# Altium project NES-NROM.PrjPCB
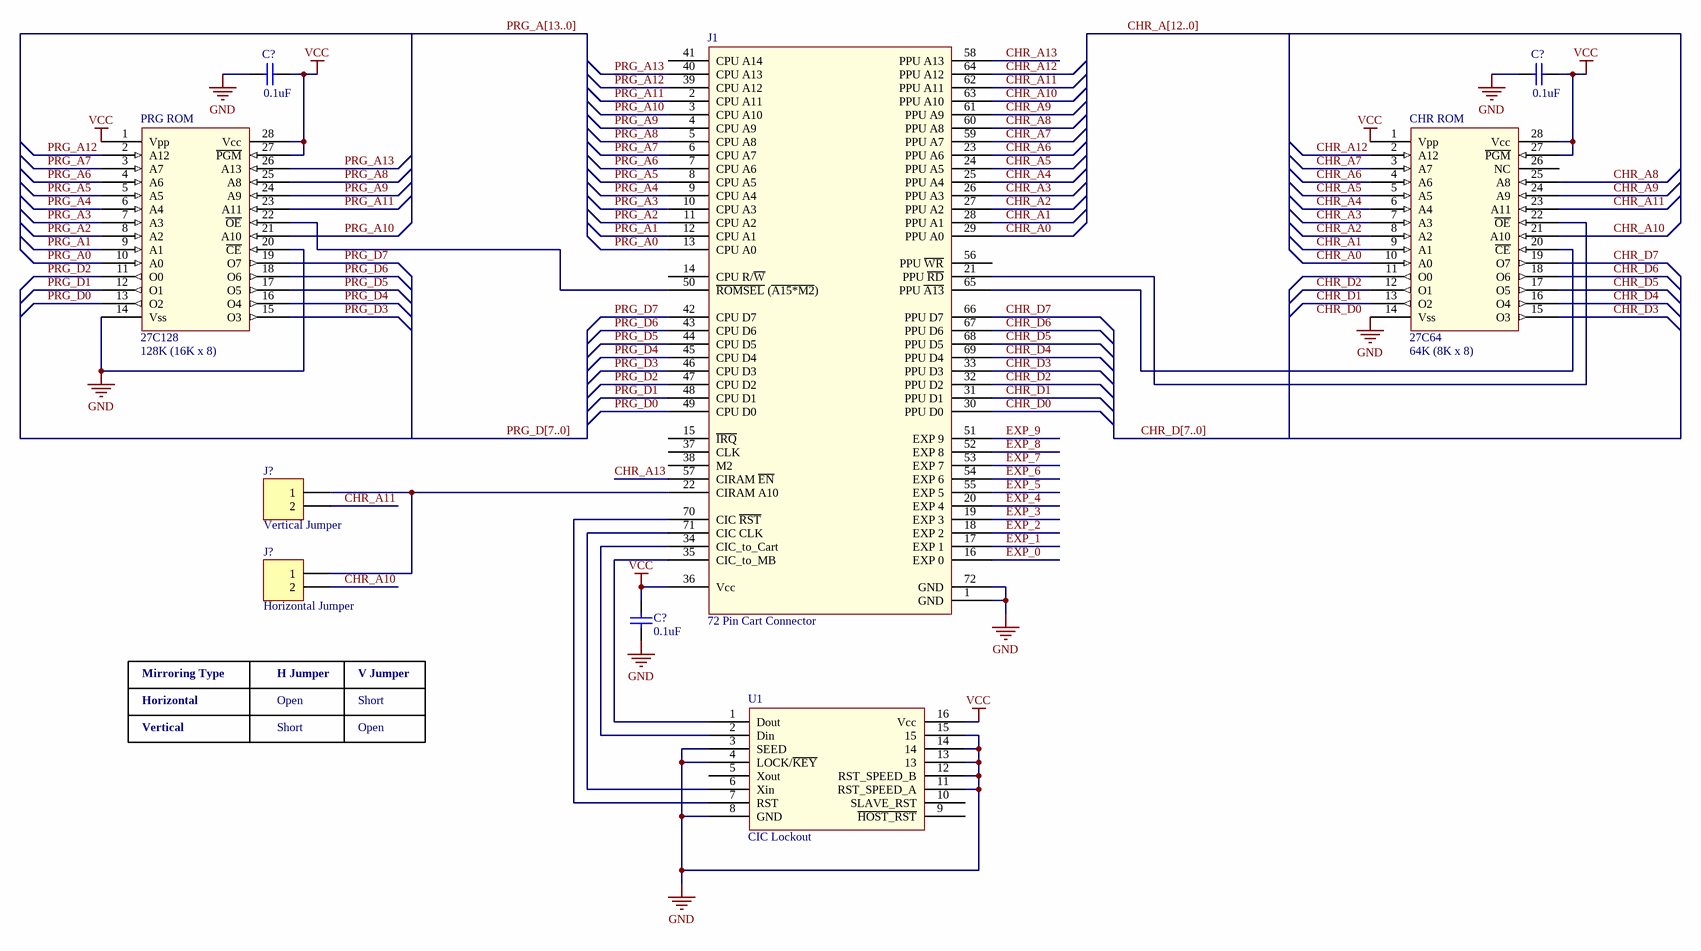
[diagram p0: NES-NROM-128.SchDoc]
ProjectRevision: 1-0-0
2 sheets, 18 parts. Net scope: global (net labels, ports and power ports of the same name join across sheets).
Sheets:
  NES-NROM-128.SchDoc
  NES-NROM-256.SchDoc

## Sheet NES-NROM-128.SchDoc: NES-NROM-128 Cartridge
size Tabloid; DrawnBy: M. Spinks; Revision: 1.0; SheetNumber: 1; SheetTotal: 1; PageSetup: Record=PageOptions|CenterHorizontal=True|CenterVertical=True|PrintScale=0.98|XCorrection=1.00|YCorrection=1.00|PrintKind=1|BorderSize=5000000|LeftOffset=0|BottomOffset=0|Orientation=2|PaperLength=1000|PaperWidth=1000|Scale=100|PaperSource=7|PrintQuality=-4|MediaType=1|DitherType=10|PaperKind=Tabloid|PrintScaleMode=1

### Parts
(Parts that share a designator on the sheet are numbered #1, #2 ... from top to bottom, then left to right.)
C?#1  value 0.1uF  [C1206]  (hidden comment: Cap Semi)
C?#2  value 0.1uF  [C1206]  (hidden comment: Cap Semi)
C?#3  value 0.1uF  [C1206]  (hidden comment: Cap Semi)
CHR_ROM#1  27C64  Memory Size: 64K (8K x 8)  [DIP600-JW28]
J1#1  72 Pin Cart Connector
J?#1  Vertical Jumper  [HDR1X2]
J?#2  Horizontal Jumper  [HDR1X2]
PRG_ROM#1  27C128  Memory Size: 128K (16K x 8)  [DIP600-JW28]
U1#1  CIC Lockout  [DIP16]

### Nets
GND: C?#1.1 C?#2.1 C?#3.1 CHR_ROM#1.14(Vss) J1#1.1(GND) J1#1.72(GND) PRG_ROM#1.14(Vss) PRG_ROM#1.20(~{CE}) U1#1.3(SEED) U1#1.4(LOCK/~{KEY}) U1#1.8(GND) U1#1.11(RST_SPEED_A) U1#1.12(RST_SPEED_B) U1#1.13 U1#1.14 U1#1.15
VCC: C?#1.2 C?#2.2 C?#3.2 CHR_ROM#1.1(Vpp) CHR_ROM#1.27(~{PGM}) CHR_ROM#1.28(Vcc) J1#1.36(Vcc) PRG_ROM#1.1(Vpp) PRG_ROM#1.27(~{PGM}) PRG_ROM#1.28(Vcc) U1#1.16(Vcc)
CHR_A0: CHR_ROM#1.10(A0) J1#1.29(PPU_A0)
CHR_A1: CHR_ROM#1.9(A1) J1#1.28(PPU_A1)
CHR_A2: CHR_ROM#1.8(A2) J1#1.27(PPU_A2)
CHR_A3: CHR_ROM#1.7(A3) J1#1.26(PPU_A3)
CHR_A4: CHR_ROM#1.6(A4) J1#1.25(PPU_A4)
CHR_A5: CHR_ROM#1.5(A5) J1#1.24(PPU_A5)
CHR_A6: CHR_ROM#1.4(A6) J1#1.23(PPU_A6)
CHR_A7: CHR_ROM#1.3(A7) J1#1.59(PPU_A7)
CHR_A8: CHR_ROM#1.25(A8) J1#1.60(PPU_A8)
CHR_A9: CHR_ROM#1.24(A9) J1#1.61(PPU_A9)
CHR_A10: CHR_ROM#1.21(A10) J1#1.63(PPU_A10) J?#2.2
CHR_A11: CHR_ROM#1.23(A11) J1#1.62(PPU_A11) J?#1.2
CHR_A12: CHR_ROM#1.2(A12) J1#1.64(PPU_A12)
CHR_A13: J1#1.57(CIRAM_~{EN}) J1#1.58(PPU_A13)
CHR_D0: J1#1.30(PPU_D0)
CHR_D1: CHR_ROM#1.13(O2) J1#1.31(PPU_D1)
CHR_D2: CHR_ROM#1.12(O1) J1#1.32(PPU_D2)
CHR_D3: CHR_ROM#1.15(O3) J1#1.33(PPU_D3)
CHR_D4: CHR_ROM#1.16(O4) J1#1.69(PPU_D4)
CHR_D5: CHR_ROM#1.17(O5) J1#1.68(PPU_D5)
CHR_D6: CHR_ROM#1.18(O6) J1#1.67(PPU_D6)
CHR_D7: CHR_ROM#1.19(O7) J1#1.66(PPU_D7)
EXP_0: J1#1.16(EXP_0)
EXP_1: J1#1.17(EXP_1)
EXP_2: J1#1.18(EXP_2)
EXP_3: J1#1.19(EXP_3)
EXP_4: J1#1.20(EXP_4)
EXP_5: J1#1.55(EXP_5)
EXP_6: J1#1.54(EXP_6)
EXP_7: J1#1.53(EXP_7)
EXP_8: J1#1.52(EXP_8)
EXP_9: J1#1.51(EXP_9)
PRG_A0: J1#1.13(CPU_A0) PRG_ROM#1.10(A0)
PRG_A1: J1#1.12(CPU_A1) PRG_ROM#1.9(A1)
PRG_A2: J1#1.11(CPU_A2) PRG_ROM#1.8(A2)
PRG_A3: J1#1.10(CPU_A3) PRG_ROM#1.7(A3)
PRG_A4: J1#1.9(CPU_A4) PRG_ROM#1.6(A4)
PRG_A5: J1#1.8(CPU_A5) PRG_ROM#1.5(A5)
PRG_A6: J1#1.7(CPU_A6) PRG_ROM#1.4(A6)
PRG_A7: J1#1.6(CPU_A7) PRG_ROM#1.3(A7)
PRG_A8: J1#1.5(CPU_A8) PRG_ROM#1.25(A8)
PRG_A9: J1#1.4(CPU_A9) PRG_ROM#1.24(A9)
PRG_A10: J1#1.3(CPU_A10) PRG_ROM#1.21(A10)
PRG_A11: J1#1.2(CPU_A11) PRG_ROM#1.23(A11)
PRG_A12: J1#1.39(CPU_A12) PRG_ROM#1.2(A12)
PRG_A13: J1#1.40(CPU_A13) PRG_ROM#1.26(A13)
PRG_D0: J1#1.49(CPU_D0) PRG_ROM#1.13(O2)
PRG_D1: J1#1.48(CPU_D1) PRG_ROM#1.12(O1)
PRG_D2: J1#1.47(CPU_D2) PRG_ROM#1.11(O0)
PRG_D3: J1#1.46(CPU_D3) PRG_ROM#1.15(O3)
PRG_D4: J1#1.45(CPU_D4) PRG_ROM#1.16(O4)
PRG_D5: J1#1.44(CPU_D5) PRG_ROM#1.17(O5)
PRG_D6: J1#1.43(CPU_D6) PRG_ROM#1.18(O6)
PRG_D7: J1#1.42(CPU_D7) PRG_ROM#1.19(O7)
NetCHR_ROM#1_20: CHR_ROM#1.20(~{CE}) J1#1.65(PPU_~{A13})
NetCHR_ROM#1_22: CHR_ROM#1.22(~{OE}) J1#1.21(PPU_~{RD})
NetJ1#1_22: J1#1.22(CIRAM_A10) J?#1.1 J?#2.1
NetJ1#1_34: J1#1.34(CIC_to_Cart) U1#1.2(Din)
NetJ1#1_35: J1#1.35(CIC_to_MB) U1#1.1(Dout)
NetJ1#1_50: J1#1.50(~{ROMSEL}_(~{A15*M2})) PRG_ROM#1.22(~{OE})
NetJ1#1_70: J1#1.70(CIC_~{RST}) U1#1.7(RST)
NetJ1#1_71: J1#1.71(CIC_CLK) U1#1.6(Xin)

Not connected (* = marked no-connect by the designer): CHR_ROM#1 11(O0) 26(NC); J1#1 14(CPU_R/~{W}) 15(~{IRQ}) 37(CLK) 38(M2) 41(CPU_A14) 56(PPU_~{WR}); U1#1 5(Xout) 9(~{HOST_RST}) 10(SLAVE_RST)

### Buses and harness runs
bus CHR_A[12..0]
bus CHR_D[7..0]
bus PRG_A[13..0]
bus PRG_D[7..0]

### Notes on the sheet
- Mirroring Type
- H Jumper
- V Jumper
- Horizontal
- Vertical
- Open
- Short
- Labels drawn without touching a wire or pin: CHR_D0
- Title
- Size:
- Date:
- Ledger
- Drawn By:
- Time:
- Revision:
- Sheet
- of
- File:

### Library data of the parts
C?#1-C?#3 = Cap Semi: Capacitor (Semiconductor SIM Model); Published: 8-Jun-2000; LatestRevisionDate: 29-May-2009; LatestRevisionNote: IPC-7351 Footprint Added.; PackageReference: C1206; Publisher: Altium Limited; PackageDescription: Chip Capacitor
CHR_ROM#1 = 27C64: 64K bit (8K x 8) EPROM - 28 pin
J1#1 = 72 Pin Cart: 72 Pin Cartridge Connector
J?#1 J?#2 = Header 2: Header, 2-Pin; LatestRevisionDate: 17-Jul-2002; LatestRevisionNote: Re-released for DXP Platform.; Publisher: Altium Limited
PRG_ROM#1 = 27C128: 128K bit (16K x 8) EPROM - 28 pin
U1#1 = CIC: 10NES CIC Lockout Chip

## Sheet NES-NROM-256.SchDoc: NES-NROM-256 Cartridge
size Tabloid; DrawnBy: M. Spinks; Revision: 1.0; SheetNumber: 1; SheetTotal: 1; PageSetup: Record=PageOptions|CenterHorizontal=True|CenterVertical=True|PrintScale=0.98|XCorrection=1.00|YCorrection=1.00|PrintKind=1|BorderSize=5000000|LeftOffset=0|BottomOffset=0|Orientation=2|PaperLength=1000|PaperWidth=1000|Scale=100|PaperSource=7|PrintQuality=-4|MediaType=1|DitherType=10|PaperKind=Tabloid|PrintScaleMode=1
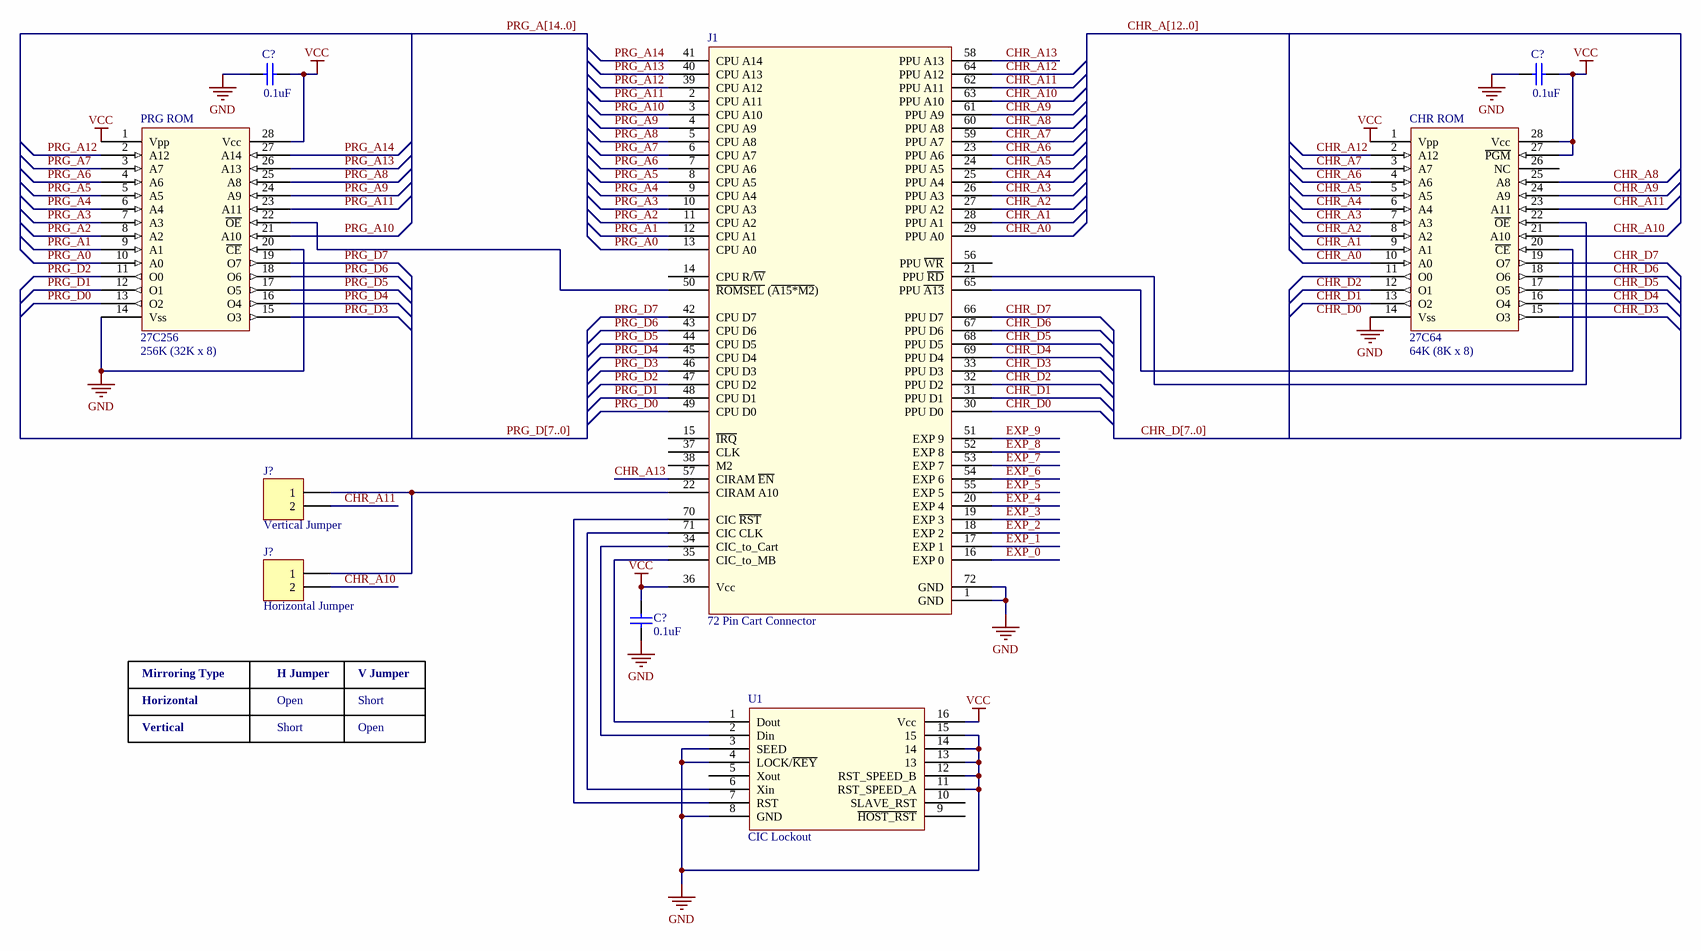
[diagram p1: NES-NROM-256.SchDoc]

### Parts
(Parts that share a designator on the sheet are numbered #1, #2 ... from top to bottom, then left to right.)
C?#4  value 0.1uF  [C1206]  (hidden comment: Cap Semi)
C?#5  value 0.1uF  [C1206]  (hidden comment: Cap Semi)
C?#6  value 0.1uF  [C1206]  (hidden comment: Cap Semi)
CHR_ROM#2  27C64  Memory Size: 64K (8K x 8)  [DIP600-JW28]
J1#2  72 Pin Cart Connector
J?#3  Vertical Jumper  [HDR1X2]
J?#4  Horizontal Jumper  [HDR1X2]
PRG_ROM#2  27C256  Memory Size: 256K (32K x 8)  [DIP600-JW28]
U1#2  CIC Lockout  [DIP16]

### Nets
GND: C?#4.1 C?#5.1 C?#6.1 CHR_ROM#2.14(Vss) J1#2.1(GND) J1#2.72(GND) PRG_ROM#2.14(Vss) PRG_ROM#2.20(~{CE}) U1#2.3(SEED) U1#2.4(LOCK/~{KEY}) U1#2.8(GND) U1#2.11(RST_SPEED_A) U1#2.12(RST_SPEED_B) U1#2.13 U1#2.14 U1#2.15
VCC: C?#4.2 C?#5.2 C?#6.2 CHR_ROM#2.1(Vpp) CHR_ROM#2.27(~{PGM}) CHR_ROM#2.28(Vcc) J1#2.36(Vcc) PRG_ROM#2.1(Vpp) PRG_ROM#2.28(Vcc) U1#2.16(Vcc)
CHR_A0: CHR_ROM#2.10(A0) J1#2.29(PPU_A0)
CHR_A1: CHR_ROM#2.9(A1) J1#2.28(PPU_A1)
CHR_A2: CHR_ROM#2.8(A2) J1#2.27(PPU_A2)
CHR_A3: CHR_ROM#2.7(A3) J1#2.26(PPU_A3)
CHR_A4: CHR_ROM#2.6(A4) J1#2.25(PPU_A4)
CHR_A5: CHR_ROM#2.5(A5) J1#2.24(PPU_A5)
CHR_A6: CHR_ROM#2.4(A6) J1#2.23(PPU_A6)
CHR_A7: CHR_ROM#2.3(A7) J1#2.59(PPU_A7)
CHR_A8: CHR_ROM#2.25(A8) J1#2.60(PPU_A8)
CHR_A9: CHR_ROM#2.24(A9) J1#2.61(PPU_A9)
CHR_A10: CHR_ROM#2.21(A10) J1#2.63(PPU_A10) J?#4.2
CHR_A11: CHR_ROM#2.23(A11) J1#2.62(PPU_A11) J?#3.2
CHR_A12: CHR_ROM#2.2(A12) J1#2.64(PPU_A12)
CHR_A13: J1#2.57(CIRAM_~{EN}) J1#2.58(PPU_A13)
CHR_D0: J1#2.30(PPU_D0)
CHR_D1: CHR_ROM#2.13(O2) J1#2.31(PPU_D1)
CHR_D2: CHR_ROM#2.12(O1) J1#2.32(PPU_D2)
CHR_D3: CHR_ROM#2.15(O3) J1#2.33(PPU_D3)
CHR_D4: CHR_ROM#2.16(O4) J1#2.69(PPU_D4)
CHR_D5: CHR_ROM#2.17(O5) J1#2.68(PPU_D5)
CHR_D6: CHR_ROM#2.18(O6) J1#2.67(PPU_D6)
CHR_D7: CHR_ROM#2.19(O7) J1#2.66(PPU_D7)
EXP_0: J1#2.16(EXP_0)
EXP_1: J1#2.17(EXP_1)
EXP_2: J1#2.18(EXP_2)
EXP_3: J1#2.19(EXP_3)
EXP_4: J1#2.20(EXP_4)
EXP_5: J1#2.55(EXP_5)
EXP_6: J1#2.54(EXP_6)
EXP_7: J1#2.53(EXP_7)
EXP_8: J1#2.52(EXP_8)
EXP_9: J1#2.51(EXP_9)
PRG_A0: J1#2.13(CPU_A0) PRG_ROM#2.10(A0)
PRG_A1: J1#2.12(CPU_A1) PRG_ROM#2.9(A1)
PRG_A2: J1#2.11(CPU_A2) PRG_ROM#2.8(A2)
PRG_A3: J1#2.10(CPU_A3) PRG_ROM#2.7(A3)
PRG_A4: J1#2.9(CPU_A4) PRG_ROM#2.6(A4)
PRG_A5: J1#2.8(CPU_A5) PRG_ROM#2.5(A5)
PRG_A6: J1#2.7(CPU_A6) PRG_ROM#2.4(A6)
PRG_A7: J1#2.6(CPU_A7) PRG_ROM#2.3(A7)
PRG_A8: J1#2.5(CPU_A8) PRG_ROM#2.25(A8)
PRG_A9: J1#2.4(CPU_A9) PRG_ROM#2.24(A9)
PRG_A10: J1#2.3(CPU_A10) PRG_ROM#2.21(A10)
PRG_A11: J1#2.2(CPU_A11) PRG_ROM#2.23(A11)
PRG_A12: J1#2.39(CPU_A12) PRG_ROM#2.2(A12)
PRG_A13: J1#2.40(CPU_A13) PRG_ROM#2.26(A13)
PRG_A14: J1#2.41(CPU_A14) PRG_ROM#2.27(A14)
PRG_D0: J1#2.49(CPU_D0) PRG_ROM#2.13(O2)
PRG_D1: J1#2.48(CPU_D1) PRG_ROM#2.12(O1)
PRG_D2: J1#2.47(CPU_D2) PRG_ROM#2.11(O0)
PRG_D3: J1#2.46(CPU_D3) PRG_ROM#2.15(O3)
PRG_D4: J1#2.45(CPU_D4) PRG_ROM#2.16(O4)
PRG_D5: J1#2.44(CPU_D5) PRG_ROM#2.17(O5)
PRG_D6: J1#2.43(CPU_D6) PRG_ROM#2.18(O6)
PRG_D7: J1#2.42(CPU_D7) PRG_ROM#2.19(O7)
NetCHR_ROM#2_20: CHR_ROM#2.20(~{CE}) J1#2.65(PPU_~{A13})
NetCHR_ROM#2_22: CHR_ROM#2.22(~{OE}) J1#2.21(PPU_~{RD})
NetJ1#2_22: J1#2.22(CIRAM_A10) J?#3.1 J?#4.1
NetJ1#2_34: J1#2.34(CIC_to_Cart) U1#2.2(Din)
NetJ1#2_35: J1#2.35(CIC_to_MB) U1#2.1(Dout)
NetJ1#2_50: J1#2.50(~{ROMSEL}_(~{A15*M2})) PRG_ROM#2.22(~{OE})
NetJ1#2_70: J1#2.70(CIC_~{RST}) U1#2.7(RST)
NetJ1#2_71: J1#2.71(CIC_CLK) U1#2.6(Xin)

Not connected (* = marked no-connect by the designer): CHR_ROM#2 11(O0) 26(NC); J1#2 14(CPU_R/~{W}) 15(~{IRQ}) 37(CLK) 38(M2) 56(PPU_~{WR}); U1#2 5(Xout) 9(~{HOST_RST}) 10(SLAVE_RST)

### Buses and harness runs
bus CHR_A[12..0]
bus CHR_D[7..0]
bus PRG_A[14..0]
bus PRG_D[7..0]

### Notes on the sheet
- Mirroring Type
- H Jumper
- V Jumper
- Horizontal
- Vertical
- Open
- Short
- Labels drawn without touching a wire or pin: CHR_D0
- Title
- Size:
- Date:
- Ledger
- Drawn By:
- Time:
- Revision:
- Sheet
- of
- File:

### Library data of the parts
C?#4-C?#6 = Cap Semi: Capacitor (Semiconductor SIM Model); Published: 8-Jun-2000; LatestRevisionDate: 29-May-2009; LatestRevisionNote: IPC-7351 Footprint Added.; PackageReference: C1206; Publisher: Altium Limited; PackageDescription: Chip Capacitor
CHR_ROM#2 = 27C64: 64K bit (8K x 8) EPROM - 28 pin
J1#2 = 72 Pin Cart: 72 Pin Cartridge Connector
J?#3 J?#4 = Header 2: Header, 2-Pin; LatestRevisionDate: 17-Jul-2002; LatestRevisionNote: Re-released for DXP Platform.; Publisher: Altium Limited
PRG_ROM#2 = 27C256: 256K bit (32K x 8) EPROM - 28 pin
U1#2 = CIC: 10NES CIC Lockout Chip

## Nets that join several sheets
GND: NES-NROM-128 (16 pins), NES-NROM-256 (16 pins)
VCC: NES-NROM-128 (11 pins), NES-NROM-256 (10 pins)
CHR_A0: NES-NROM-128 (CHR_ROM#1.10 J1#1.29), NES-NROM-256 (CHR_ROM#2.10 J1#2.29)
CHR_A1: NES-NROM-128 (CHR_ROM#1.9 J1#1.28), NES-NROM-256 (CHR_ROM#2.9 J1#2.28)
CHR_A2: NES-NROM-128 (CHR_ROM#1.8 J1#1.27), NES-NROM-256 (CHR_ROM#2.8 J1#2.27)
CHR_A3: NES-NROM-128 (CHR_ROM#1.7 J1#1.26), NES-NROM-256 (CHR_ROM#2.7 J1#2.26)
CHR_A4: NES-NROM-128 (CHR_ROM#1.6 J1#1.25), NES-NROM-256 (CHR_ROM#2.6 J1#2.25)
CHR_A5: NES-NROM-128 (CHR_ROM#1.5 J1#1.24), NES-NROM-256 (CHR_ROM#2.5 J1#2.24)
CHR_A6: NES-NROM-128 (CHR_ROM#1.4 J1#1.23), NES-NROM-256 (CHR_ROM#2.4 J1#2.23)
CHR_A7: NES-NROM-128 (CHR_ROM#1.3 J1#1.59), NES-NROM-256 (CHR_ROM#2.3 J1#2.59)
CHR_A8: NES-NROM-128 (CHR_ROM#1.25 J1#1.60), NES-NROM-256 (CHR_ROM#2.25 J1#2.60)
CHR_A9: NES-NROM-128 (CHR_ROM#1.24 J1#1.61), NES-NROM-256 (CHR_ROM#2.24 J1#2.61)
CHR_A10: NES-NROM-128 (CHR_ROM#1.21 J1#1.63 J?#2.2), NES-NROM-256 (CHR_ROM#2.21 J1#2.63 J?#4.2)
CHR_A11: NES-NROM-128 (CHR_ROM#1.23 J1#1.62 J?#1.2), NES-NROM-256 (CHR_ROM#2.23 J1#2.62 J?#3.2)
CHR_A12: NES-NROM-128 (CHR_ROM#1.2 J1#1.64), NES-NROM-256 (CHR_ROM#2.2 J1#2.64)
CHR_A13: NES-NROM-128 (J1#1.57 J1#1.58), NES-NROM-256 (J1#2.57 J1#2.58)
CHR_D0: NES-NROM-128 (J1#1.30), NES-NROM-256 (J1#2.30)
CHR_D1: NES-NROM-128 (CHR_ROM#1.13 J1#1.31), NES-NROM-256 (CHR_ROM#2.13 J1#2.31)
CHR_D2: NES-NROM-128 (CHR_ROM#1.12 J1#1.32), NES-NROM-256 (CHR_ROM#2.12 J1#2.32)
CHR_D3: NES-NROM-128 (CHR_ROM#1.15 J1#1.33), NES-NROM-256 (CHR_ROM#2.15 J1#2.33)
CHR_D4: NES-NROM-128 (CHR_ROM#1.16 J1#1.69), NES-NROM-256 (CHR_ROM#2.16 J1#2.69)
CHR_D5: NES-NROM-128 (CHR_ROM#1.17 J1#1.68), NES-NROM-256 (CHR_ROM#2.17 J1#2.68)
CHR_D6: NES-NROM-128 (CHR_ROM#1.18 J1#1.67), NES-NROM-256 (CHR_ROM#2.18 J1#2.67)
CHR_D7: NES-NROM-128 (CHR_ROM#1.19 J1#1.66), NES-NROM-256 (CHR_ROM#2.19 J1#2.66)
EXP_0: NES-NROM-128 (J1#1.16), NES-NROM-256 (J1#2.16)
EXP_1: NES-NROM-128 (J1#1.17), NES-NROM-256 (J1#2.17)
EXP_2: NES-NROM-128 (J1#1.18), NES-NROM-256 (J1#2.18)
EXP_3: NES-NROM-128 (J1#1.19), NES-NROM-256 (J1#2.19)
EXP_4: NES-NROM-128 (J1#1.20), NES-NROM-256 (J1#2.20)
EXP_5: NES-NROM-128 (J1#1.55), NES-NROM-256 (J1#2.55)
EXP_6: NES-NROM-128 (J1#1.54), NES-NROM-256 (J1#2.54)
EXP_7: NES-NROM-128 (J1#1.53), NES-NROM-256 (J1#2.53)
EXP_8: NES-NROM-128 (J1#1.52), NES-NROM-256 (J1#2.52)
EXP_9: NES-NROM-128 (J1#1.51), NES-NROM-256 (J1#2.51)
PRG_A0: NES-NROM-128 (J1#1.13 PRG_ROM#1.10), NES-NROM-256 (J1#2.13 PRG_ROM#2.10)
PRG_A1: NES-NROM-128 (J1#1.12 PRG_ROM#1.9), NES-NROM-256 (J1#2.12 PRG_ROM#2.9)
PRG_A2: NES-NROM-128 (J1#1.11 PRG_ROM#1.8), NES-NROM-256 (J1#2.11 PRG_ROM#2.8)
PRG_A3: NES-NROM-128 (J1#1.10 PRG_ROM#1.7), NES-NROM-256 (J1#2.10 PRG_ROM#2.7)
PRG_A4: NES-NROM-128 (J1#1.9 PRG_ROM#1.6), NES-NROM-256 (J1#2.9 PRG_ROM#2.6)
PRG_A5: NES-NROM-128 (J1#1.8 PRG_ROM#1.5), NES-NROM-256 (J1#2.8 PRG_ROM#2.5)
PRG_A6: NES-NROM-128 (J1#1.7 PRG_ROM#1.4), NES-NROM-256 (J1#2.7 PRG_ROM#2.4)
PRG_A7: NES-NROM-128 (J1#1.6 PRG_ROM#1.3), NES-NROM-256 (J1#2.6 PRG_ROM#2.3)
PRG_A8: NES-NROM-128 (J1#1.5 PRG_ROM#1.25), NES-NROM-256 (J1#2.5 PRG_ROM#2.25)
PRG_A9: NES-NROM-128 (J1#1.4 PRG_ROM#1.24), NES-NROM-256 (J1#2.4 PRG_ROM#2.24)
PRG_A10: NES-NROM-128 (J1#1.3 PRG_ROM#1.21), NES-NROM-256 (J1#2.3 PRG_ROM#2.21)
PRG_A11: NES-NROM-128 (J1#1.2 PRG_ROM#1.23), NES-NROM-256 (J1#2.2 PRG_ROM#2.23)
PRG_A12: NES-NROM-128 (J1#1.39 PRG_ROM#1.2), NES-NROM-256 (J1#2.39 PRG_ROM#2.2)
PRG_A13: NES-NROM-128 (J1#1.40 PRG_ROM#1.26), NES-NROM-256 (J1#2.40 PRG_ROM#2.26)
PRG_D0: NES-NROM-128 (J1#1.49 PRG_ROM#1.13), NES-NROM-256 (J1#2.49 PRG_ROM#2.13)
PRG_D1: NES-NROM-128 (J1#1.48 PRG_ROM#1.12), NES-NROM-256 (J1#2.48 PRG_ROM#2.12)
PRG_D2: NES-NROM-128 (J1#1.47 PRG_ROM#1.11), NES-NROM-256 (J1#2.47 PRG_ROM#2.11)
PRG_D3: NES-NROM-128 (J1#1.46 PRG_ROM#1.15), NES-NROM-256 (J1#2.46 PRG_ROM#2.15)
PRG_D4: NES-NROM-128 (J1#1.45 PRG_ROM#1.16), NES-NROM-256 (J1#2.45 PRG_ROM#2.16)
PRG_D5: NES-NROM-128 (J1#1.44 PRG_ROM#1.17), NES-NROM-256 (J1#2.44 PRG_ROM#2.17)
PRG_D6: NES-NROM-128 (J1#1.43 PRG_ROM#1.18), NES-NROM-256 (J1#2.43 PRG_ROM#2.18)
PRG_D7: NES-NROM-128 (J1#1.42 PRG_ROM#1.19), NES-NROM-256 (J1#2.42 PRG_ROM#2.19)